# EasyEDA schematic SCH_Navigation_Board_CapibaraZero_2024-04-09.json

## Sheets
1 MainScheme: TITLE: CapibaraZero_Arduino_Nano_ESP32; REV: 1.0; Date: 2024-04-09; Sheet: 1/1; Drawn By: Andrea Canale; Company: CapibaraZero
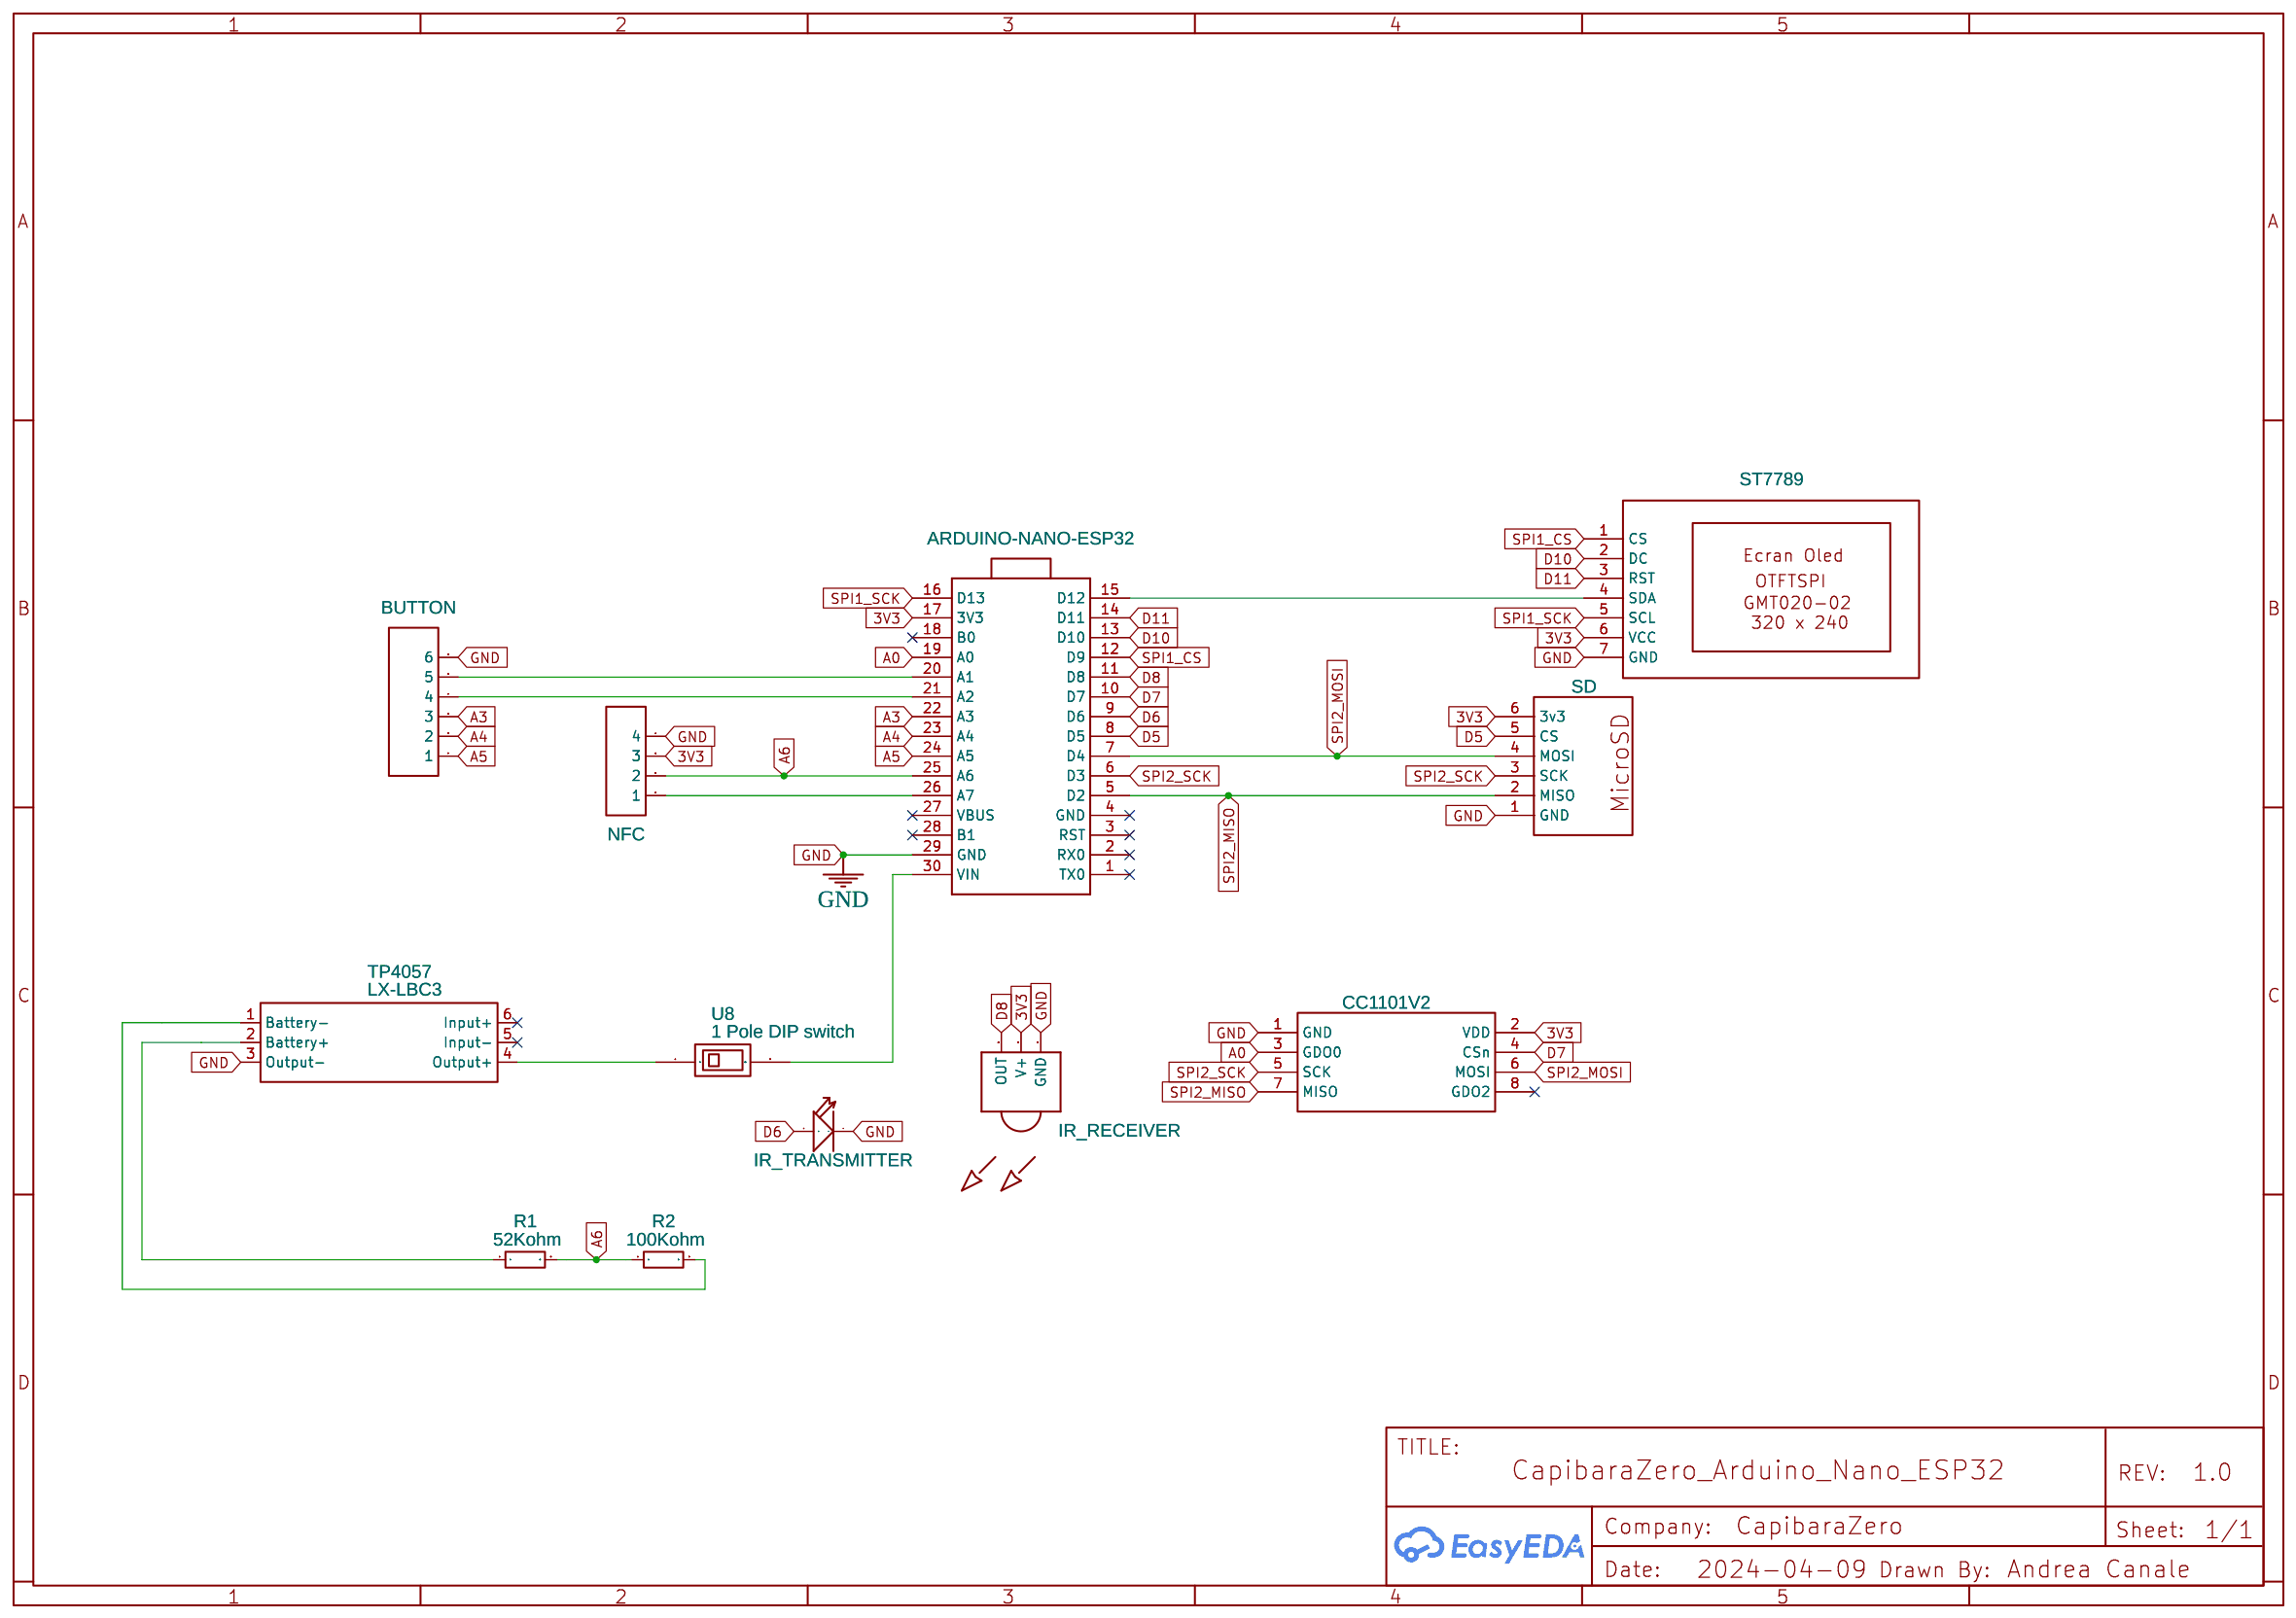
[diagram p0: MainScheme]
2 Navigation_board: TITLE: Navigation Board; Date: 2024-02-09; Drawn By: vivanco11.ac; Company: Your Company
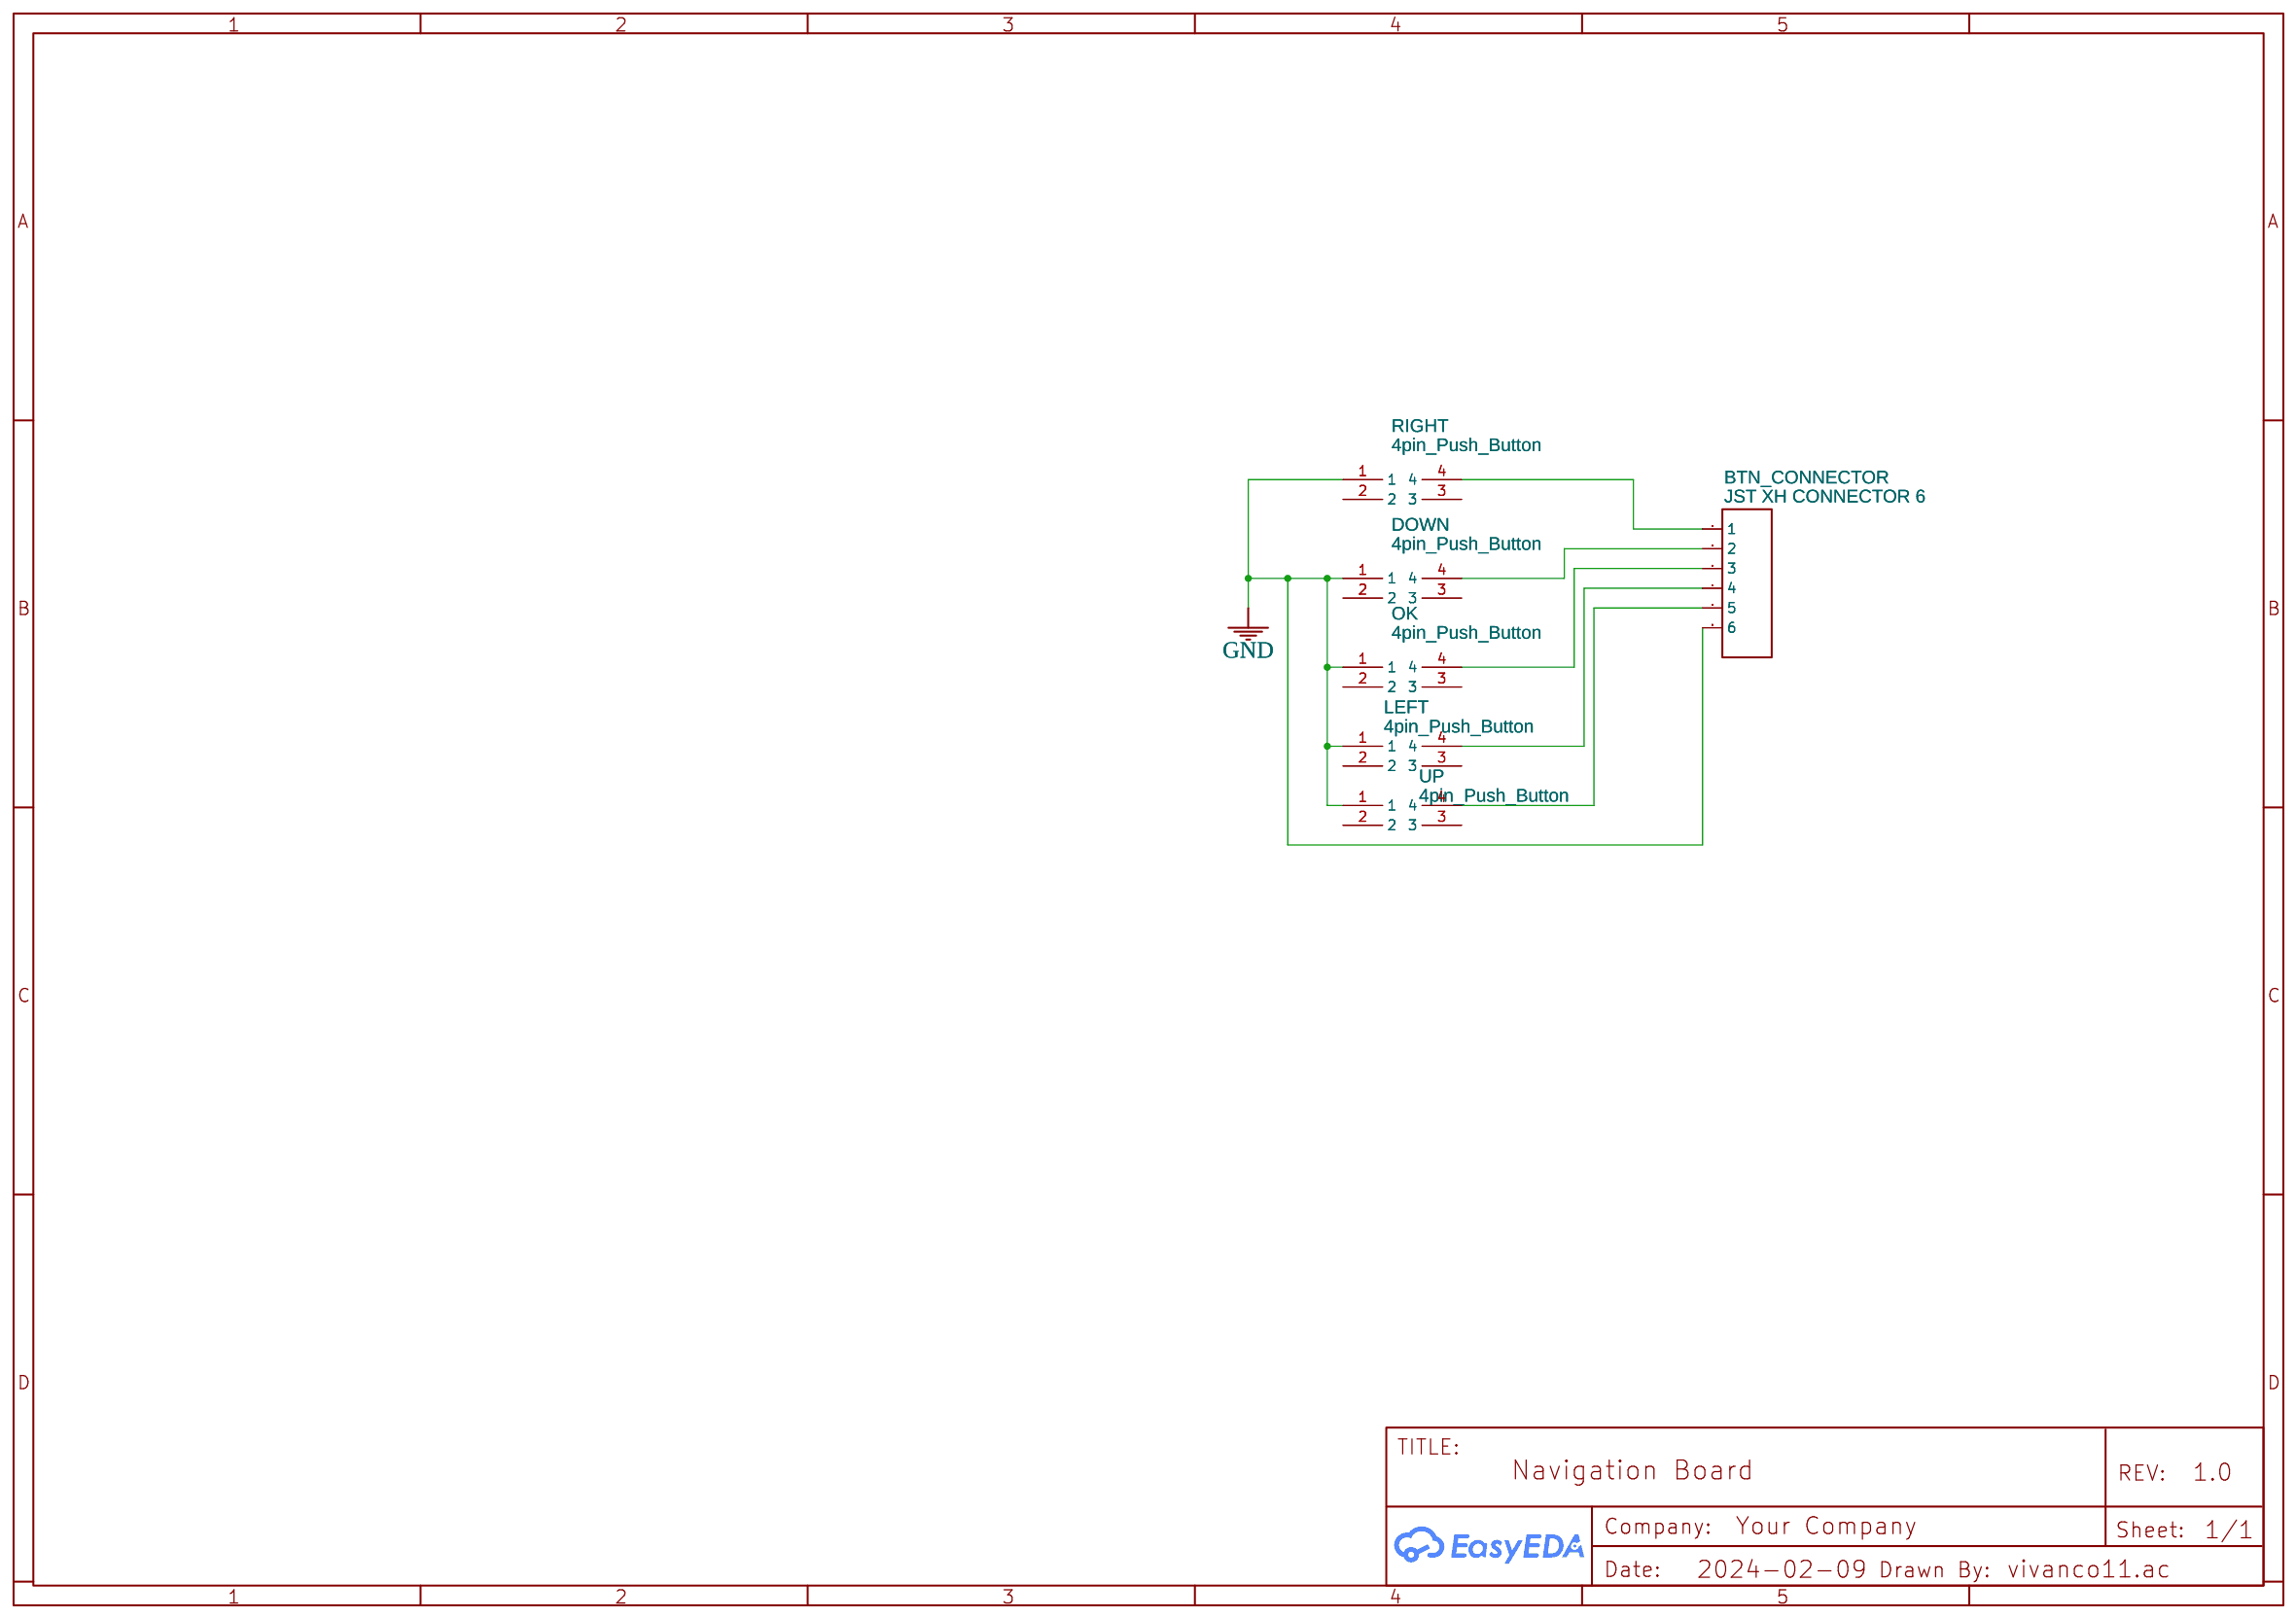
[diagram p1: Navigation_board]

## Parts
sheet MainScheme
ARDUINO-NANO-ESP32  ARDUINO-NANO-ESP32  [ARDUINO-NANO-V3.0]
BUTTON  BTN Connector  [JST XH 6 PIN]
CC1101V2  CC1101 E07-M1101D  [CC1101V2]
IR_RECEIVER  IR Receiver  [TSOP18XX]
IR_TRANSMITTER  DIP-IR-LED-940NM(2P-D5MM)  [LED2-2.54-D5.0MM]
NFC  NFC Connector  [JST_XH_4X2.54MM]
R1  52Kohm  [RESISTOR]
R2  100Kohm  [RESISTOR]
SD  MicroSDSPI  [MICROSD SOCKET]
ST7789  ST7789_Display_320x240_SPI  [2.0 TFT SPI-MUS BARETTE]
TP4057  LX-LBC3  [LX-LBC3]
U8  1 Pole DIP switch  [1 POSITION DIP SWITCH]
sheet Navigation_board
BTN_CONNECTOR  JST XH CONNECTOR 6  [JST XH 6 PIN]
DOWN  4pin_Push_Button  [PUSH BUTTON 4 PIN DIP]
LEFT  4pin_Push_Button  [PUSH BUTTON 4 PIN DIP]
OK  4pin_Push_Button  [PUSH BUTTON 4 PIN DIP]
RIGHT  4pin_Push_Button  [PUSH BUTTON 4 PIN DIP]
UP  4pin_Push_Button  [PUSH BUTTON 4 PIN DIP]

## Library data of the parts
ARDUINO-NANO-ESP32 = ARDUINO-NANO-ESP32: sourceId: VqeOavtdN; Contributor: vivanco11.ac; Manufacturer: Arduino
BTN_CONNECTOR BUTTON = JST XH CONNECTOR 6: Manufacturer Part: JST_XH CONNECTOR; link: https://nl.aliexpress.com/item/50-sets-Kit-in-doos-2-p-3-p-4-pin-2-54mm-Pitch-Terminal-Behuizing/32681086028.html?spm=a2g0s.9042311.0.0.I0g15Z; Contributor: vivanco11.ac
CC1101V2 = CC1101 E07-M1101D: Manufacturer: Chengdu Ebyte Electronic Technology Co., Ltd.; Manufacturer Part: E07-M1101D-SMA; Supplier: Ebyte; Supplier Part: E07-M1101D-SMA; link: http://www.ebyte.com/en/downpdf.aspx?id=165; Contributor: vivanco11.ac
IR_RECEIVER = IR TRANSMITTER: sourceId: vOawSeXH3; Contributor: vivanco11.ac
IR_TRANSMITTER = DIP-IR-LED-940NM(2P-D5MM): DIP IR LED 940nm; Supplier Part: 304090159; Supplier: SeeedStudio; Manufacturer Part: IR523B-W60W1; sourceId: iIBTN5nFX; Contributor: vivanco11.ac
NFC = JST XH CONNECTOR 4: Manufacturer Part: JST_XH CONNECTOR; link: https://nl.aliexpress.com/item/50-sets-Kit-in-doos-2-p-3-p-4-pin-2-54mm-Pitch-Terminal-Behuizing/32681086028.html?spm=a2g0s.9042311.0.0.I0g15Z; Contributor: vivanco11.ac
R1 R2 = Resistor Normal: Supplier: LCSC; Supplier Part: X16151710; Manufacturer: ResistorToday; Manufacturer Part: EWWR0001J20R0T9; Contributor: vivanco11.ac
SD = MicroSDSPI: catid: 20; Contributor: vivanco11.ac; sim: true
ST7789 = ST7789_Display_320x240_SPI: Contributor: vivanco11.ac
TP4057 = LX-LBC3: Contributor: vivanco11.ac
U8 = 1 Pole DIP switch: Contributor: vivanco11.ac
DOWN LEFT OK RIGHT UP = 4pin_Push_Button: Contributor: vivanco11.ac

## Nets
3V3: ARDUINO-NANO-ESP32.17(3V3) CC1101V2.2(VDD) IR_RECEIVER.VCC(V+) NFC.3 SD.6(3v3) ST7789.6(VCC)
GND: ARDUINO-NANO-ESP32.29(GND) BTN_CONNECTOR.6 BUTTON.6 CC1101V2.1(GND) DOWN.1 IR_RECEIVER.GND IR_TRANSMITTER.- LEFT.1 NFC.4 OK.1 RIGHT.1 SD.1(GND) ST7789.7(GND) TP4057.3(Output-) UP.1
A0: ARDUINO-NANO-ESP32.19(A0) CC1101V2.3(GDO0)
A3: ARDUINO-NANO-ESP32.22(A3) BUTTON.3
A4: ARDUINO-NANO-ESP32.23(A4) BUTTON.2
A5: ARDUINO-NANO-ESP32.24(A5) BUTTON.1
A6: ARDUINO-NANO-ESP32.25(A6) NFC.2 R1.2 R2.1
D5: ARDUINO-NANO-ESP32.8(D5) SD.5(CS)
D6: ARDUINO-NANO-ESP32.9(D6) IR_TRANSMITTER.+
D7: ARDUINO-NANO-ESP32.10(D7) CC1101V2.4(CSn)
D8: ARDUINO-NANO-ESP32.11(D8) IR_RECEIVER.OUT
D10: ARDUINO-NANO-ESP32.13(D10) ST7789.2(DC)
D11: ARDUINO-NANO-ESP32.14(D11) ST7789.3(RST)
SPI1_CS: ARDUINO-NANO-ESP32.12(D9) ST7789.1(CS)
SPI1_SCK: ARDUINO-NANO-ESP32.16(D13) ST7789.5(SCL)
SPI2_MISO: ARDUINO-NANO-ESP32.5(D2) CC1101V2.7(MISO) SD.2(MISO)
SPI2_MOSI: ARDUINO-NANO-ESP32.7(D4) CC1101V2.6(MOSI) SD.4(MOSI)
SPI2_SCK: ARDUINO-NANO-ESP32.6(D3) CC1101V2.5(SCK) SD.3(SCK)
Net-(ARDUINO-NANO-ESP32-15): ARDUINO-NANO-ESP32.15(D12) ST7789.4(SDA)
Net-(ARDUINO-NANO-ESP32-20): ARDUINO-NANO-ESP32.20(A1) BUTTON.5
Net-(ARDUINO-NANO-ESP32-21): ARDUINO-NANO-ESP32.21(A2) BUTTON.4
Net-(ARDUINO-NANO-ESP32-26): ARDUINO-NANO-ESP32.26(A7) NFC.1
Net-(ARDUINO-NANO-ESP32-30): ARDUINO-NANO-ESP32.30(VIN) U8.2(OUT)
Net-(BTN_CONNECTOR-1): BTN_CONNECTOR.1 RIGHT.4
Net-(BTN_CONNECTOR-2): BTN_CONNECTOR.2 DOWN.4
Net-(BTN_CONNECTOR-3): BTN_CONNECTOR.3 OK.4
Net-(BTN_CONNECTOR-4): BTN_CONNECTOR.4 LEFT.4
Net-(BTN_CONNECTOR-5): BTN_CONNECTOR.5 UP.4
Net-(R1-1): R1.1 TP4057.2(Battery+)
Net-(R2-2): R2.2 TP4057.1(Battery-)
Net-(TP4057-4): TP4057.4(Output+) U8.1(IN)

Not connected (* = marked no-connect by the designer): ARDUINO-NANO-ESP32 1(TX0)* 2(RX0)* 3(RST)* 4(GND)* 18(B0)* 27(VBUS)* 28(B1)*; CC1101V2 8(GDO2)*; DOWN 2 3; LEFT 2 3; OK 2 3; RIGHT 2 3; TP4057 5(Input-)* 6(Input+)*; UP 2 3
